# EAGLE schematic main (EAGLE 8.7.1)

## Sheet 1 of 4: Main board
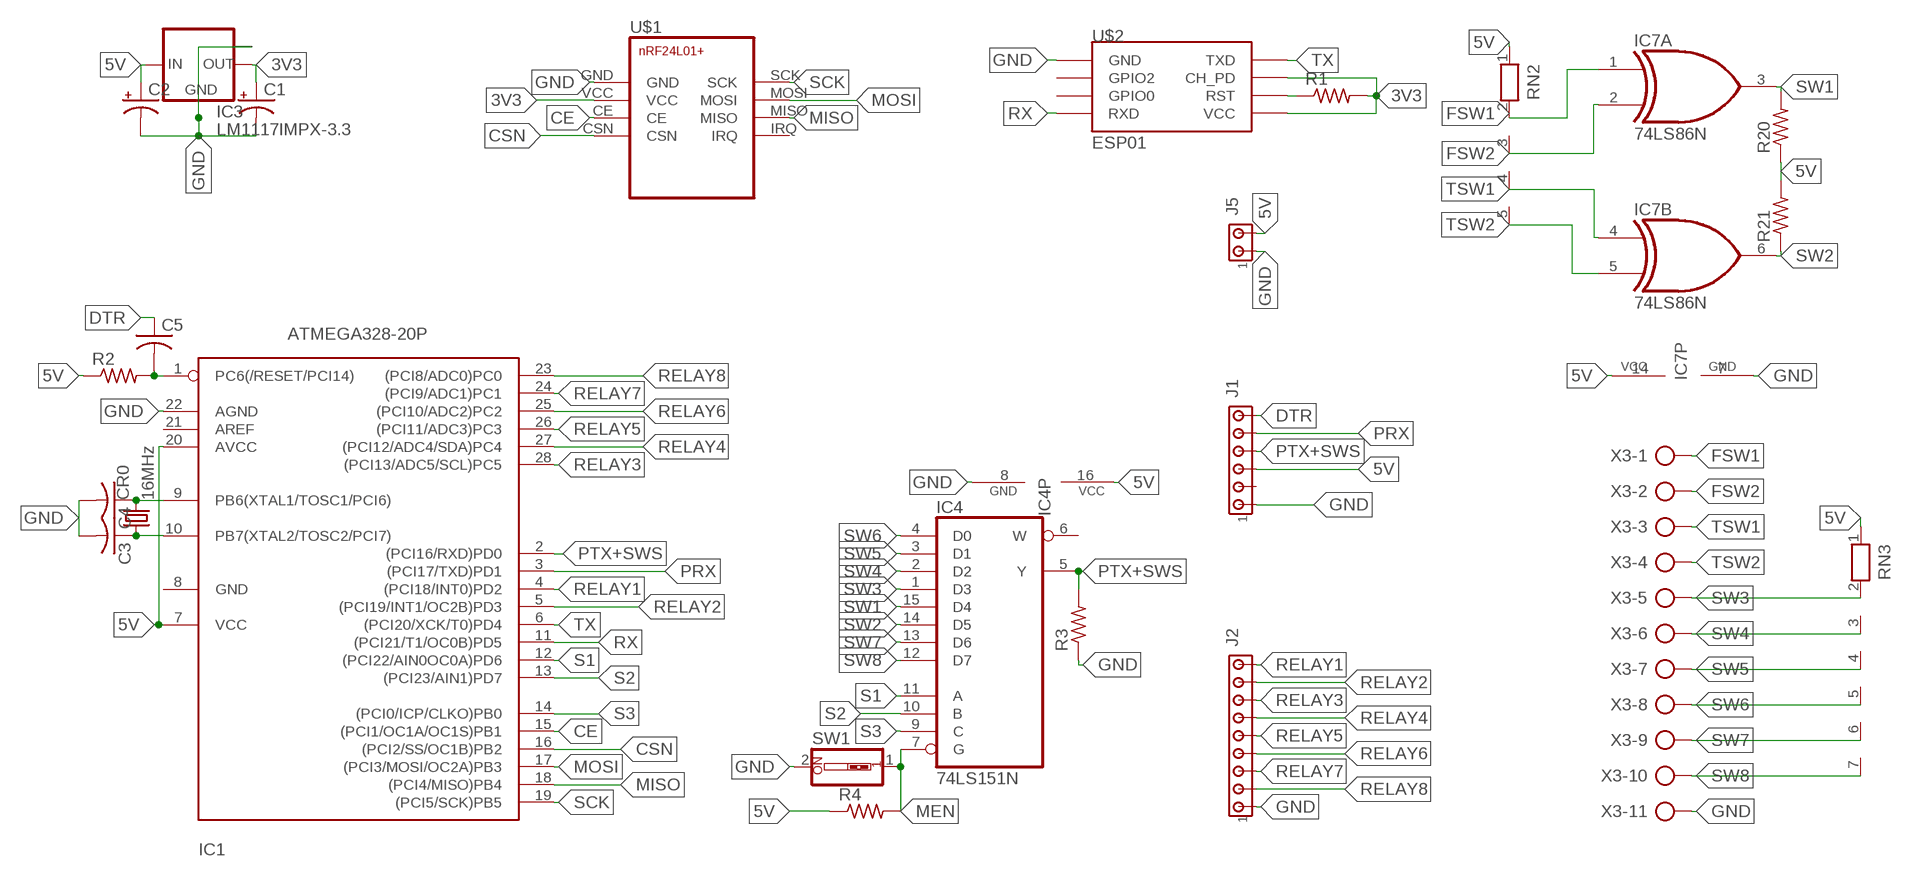
[diagram p0: schematic, sheet 1]

### Parts
C1  CPOL-USE2,5-6E  [E2,5-6E]
C2  CPOL-USE2,5-6E  [E2,5-6E]
C3  C-USC1206  [C1206]
C4  C-USC1206  [C1206]
C5  C-USC1206  [C1206]
CR0  16MHz  CRYSTALHC18U-V  [HC18U-V]
IC1  ATMEGA328-20P  [DIL28-3]
IC3  LM1117IMPX-3.3  [SOT223]
IC4  74LS151N  [DIL16]
IC7  74LS86N  [DIL14]
J1  MTA06-100  [10X06MTA]
J2  MTA09-100  [10X09MTA]
J5  MTA02-100  [10X02MTA]
R1  R-US_R1206  [R1206]
R2  R-US_R1206  [R1206]
R3  R-US_R1206  [R1206]
R4  R-US_R1206  [R1206]
R20  R-US_0204/7  [0204/7]
R21  R-US_R1206  [R1206]
RN2  RN04  [RN-5]
RN3  RN06  [RN-7]
SW1  SW_DIP-1  [EDG-01]
U$1  NRF24L01+  [NRF24L01+]
U$2  ESP01  [ESP01]
X3  AK300/11  [AK300/11]

### Nets
3V3: C1.+ IC3.2(OUT) R1.2 U$1.VCC U$2.CH_PD U$2.VCC
5V: C2.+ IC1.7(VCC) IC1.20(AVCC) IC3.3(IN) IC4.16(VCC) IC7.14(P:VCC) J1.3 J5.2 R2.1 R4.1 R20.1 R21.2 RN2.1 RN3.1
CE: IC1.15((PCI1/OC1A/OC1S)PB1) U$1.CE
CR1: C4.1 CR0.2 IC1.9(PB6(XTAL1/TOSC1/PCI6))
CR2: C3.1 CR0.1 IC1.10(PB7(XTAL2/TOSC2/PCI7))
CSN: IC1.16((PCI2/SS/OC1B)PB2) U$1.CSN
DTR: C5.1 J1.6
ERST: R1.1 U$2.RST
FSW1: IC7.1(A:I0) RN2.2 X3.1
FSW2: IC7.2(A:I1) RN2.3 X3.2
GND: C1.- C2.- C3.2 C4.2 IC1.22(AGND) IC3.1(GND) IC3.TAB(OUT1) IC4.8(GND) IC7.7(P:GND) J1.1 J2.1 J5.1 R3.1 SW1.2 U$1.GND U$2.GND X3.11
MEN: IC4.7(G) R4.2 SW1.1
MISO: IC1.18((PCI4/MISO)PB4) U$1.MISO
MOSI: IC1.17((PCI3/MOSI/OC2A)PB3) U$1.MOSI
MRST: C5.2 IC1.1(PC6(/RESET/PCI14)) R2.2
PRX: IC1.3((PCI17/TXD)PD1) J1.5
PTX+SWS: IC1.2((PCI16/RXD)PD0) IC4.5(Y) J1.4 R3.2
RELAY1: IC1.4((PCI18/INT0)PD2) J2.9
RELAY2: IC1.5((PCI19/INT1/OC2B)PD3) J2.8
RELAY3: IC1.28((PCI13/ADC5/SCL)PC5) J2.7
RELAY4: IC1.27((PCI12/ADC4/SDA)PC4) J2.6
RELAY5: IC1.26((PCI11/ADC3)PC3) J2.5
RELAY6: IC1.25((PCI10/ADC2)PC2) J2.4
RELAY7: IC1.24((PCI9/ADC1)PC1) J2.3
RELAY8: IC1.23((PCI8/ADC0)PC0) J2.2
RX: IC1.11((PCI21/T1/OC0B)PD5) U$2.RX(RXD)
S1: IC1.12((PCI22/AIN0OC0A)PD6) IC4.11(A)
S2: IC1.13((PCI23/AIN1)PD7) IC4.10(B)
S3: IC1.14((PCI0/ICP/CLKO)PB0) IC4.9(C)
SCK: IC1.19((PCI5/SCK)PB5) U$1.SCK
SW1: IC4.15(D4) IC7.3(A:O) R20.2
SW2: IC4.14(D5) IC7.6(B:O) R21.1
SW3: IC4.1(D3) RN3.2 X3.5
SW4: IC4.2(D2) RN3.3 X3.6
SW5: IC4.3(D1) RN3.4 X3.7
SW6: IC4.4(D0) RN3.5 X3.8
SW7: IC4.13(D6) RN3.6 X3.9
SW8: IC4.12(D7) RN3.7 X3.10
TSW1: IC7.4(B:I0) RN2.4 X3.3
TSW2: IC7.5(B:I1) RN2.5 X3.4
TX: IC1.6((PCI20/XCK/T0)PD4) U$2.TX(TXD)
Unconnected: IC1.8(GND) IC1.21(AREF) IC4.6(W) IC7.8(C:O) IC7.9(C:I0) IC7.10(C:I1) IC7.11(D:O) IC7.12(D:I0) IC7.13(D:I1) J1.2 U$1.IRQ U$2.GPIO0 U$2.GPIO2

## Sheet 2 of 4: Node 1 (6 relays)
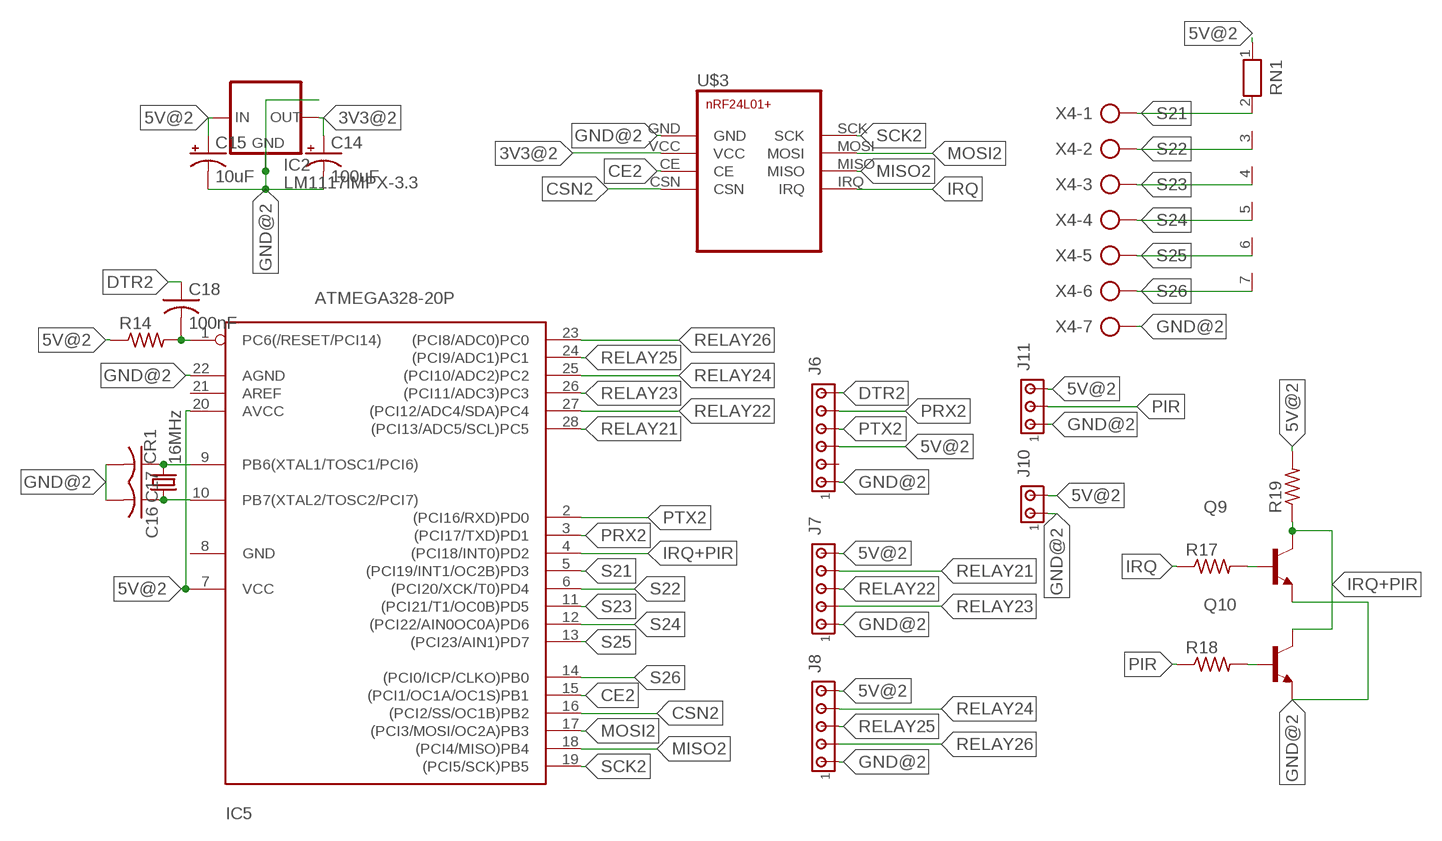
[diagram p1: schematic, sheet 2]

### Parts
C14  100uF  CPOL-USE2,5-6E  [E2,5-6E]
C15  10uF  CPOL-USE2,5-6E  [E2,5-6E]
C16  C-USC1206  [C1206]
C17  C-USC1206  [C1206]
C18  100nF  C-USC1206  [C1206]
CR1  16MHz  CRYSTALHC18U-V  [HC18U-V]
IC2  LM1117IMPX-3.3  [SOT223]
IC5  ATMEGA328-20P  [DIL28-3]
J6  MTA06-100  [10X06MTA]
J7  MTA05-100  [10X05MTA]
J8  MTA05-100  [10X05MTA]
J10  MTA02-100  [10X02MTA]
J11  MTA03-100  [10X03MTA]
Q9  -NPN-SOT89-BCE  [SOT89-BCE]
Q10  -NPN-SOT89-BCE  [SOT89-BCE]
R14  R-US_R1206  [R1206]
R17  R-US_R1206  [R1206]
R18  R-US_R1206  [R1206]
R19  R-US_R1206  [R1206]
RN1  RN06  [RN-7]
U$3  NRF24L01+  [NRF24L01+]
X4  AK300/7  [AK300/7]

### Nets
3V3@2: C14.+ IC2.2(OUT) U$3.VCC
5V@2: C15.+ IC2.3(IN) IC5.7(VCC) IC5.20(AVCC) J6.3 J7.5 J8.5 J10.2 J11.3 R14.1 R19.2 RN1.1
CE2: IC5.15((PCI1/OC1A/OC1S)PB1) U$3.CE
CR3: C16.1 CR1.1 IC5.10(PB7(XTAL2/TOSC2/PCI7))
CR4: C17.1 CR1.2 IC5.9(PB6(XTAL1/TOSC1/PCI6))
CSN2: IC5.16((PCI2/SS/OC1B)PB2) U$3.CSN
DTR2: C18.1 J6.6
GND@2: C14.- C15.- C16.2 C17.2 IC2.1(GND) IC2.TAB(OUT1) IC5.22(AGND) J6.1 J7.1 J8.1 J10.1 J11.1 Q9.E Q10.E U$3.GND X4.7
IRQ: R17.1 U$3.IRQ
IRQ+PIR: IC5.4((PCI18/INT0)PD2) Q9.C Q10.C R19.1
MISO2: IC5.18((PCI4/MISO)PB4) U$3.MISO
MOSI2: IC5.17((PCI3/MOSI/OC2A)PB3) U$3.MOSI
MRST1: C18.2 IC5.1(PC6(/RESET/PCI14)) R14.2
N$49: Q9.B R17.2
N$50: Q10.B R18.2
PIR: J11.2 R18.1
PRX2: IC5.3((PCI17/TXD)PD1) J6.5
PTX2: IC5.2((PCI16/RXD)PD0) J6.4
RELAY21: IC5.28((PCI13/ADC5/SCL)PC5) J7.4
RELAY22: IC5.27((PCI12/ADC4/SDA)PC4) J7.3
RELAY23: IC5.26((PCI11/ADC3)PC3) J7.2
RELAY24: IC5.25((PCI10/ADC2)PC2) J8.4
RELAY25: IC5.24((PCI9/ADC1)PC1) J8.3
RELAY26: IC5.23((PCI8/ADC0)PC0) J8.2
S21: IC5.5((PCI19/INT1/OC2B)PD3) RN1.2 X4.1
S22: IC5.6((PCI20/XCK/T0)PD4) RN1.3 X4.2
S23: IC5.11((PCI21/T1/OC0B)PD5) RN1.4 X4.3
S24: IC5.12((PCI22/AIN0OC0A)PD6) RN1.5 X4.4
S25: IC5.13((PCI23/AIN1)PD7) RN1.6 X4.5
S26: IC5.14((PCI0/ICP/CLKO)PB0) RN1.7 X4.6
SCK2: IC5.19((PCI5/SCK)PB5) U$3.SCK
Unconnected: IC5.8(GND) IC5.21(AREF) J6.2

## Sheet 3 of 4: Relay board - 9
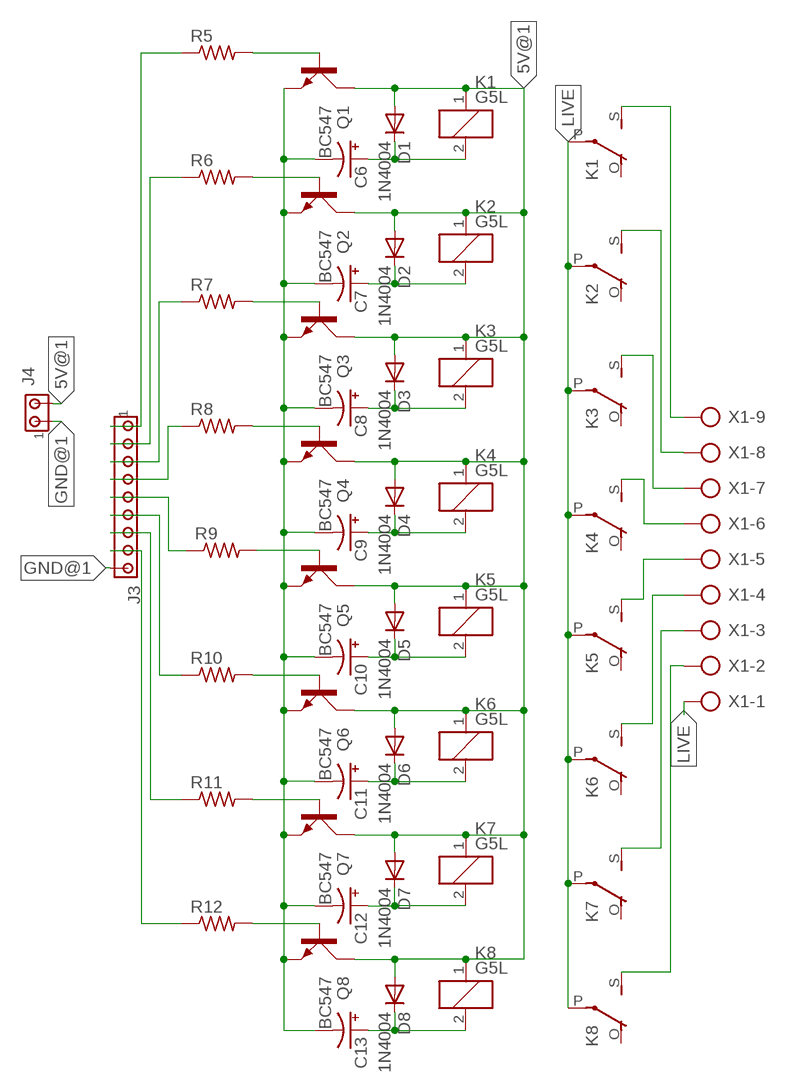
[diagram p2: schematic, sheet 3]

### Parts
C6  CPOL-USE2.5-6  [E2,5-6]
C7  CPOL-USE2.5-6  [E2,5-6]
C8  CPOL-USE2.5-6  [E2,5-6]
C9  CPOL-USE2.5-6  [E2,5-6]
C10  CPOL-USE2.5-6  [E2,5-6]
C11  CPOL-USE2.5-6  [E2,5-6]
C12  CPOL-USE2.5-6  [E2,5-6]
C13  CPOL-USE2.5-6  [E2,5-6]
D1  1N4004  [DO41-10]
D2  1N4004  [DO41-10]
D3  1N4004  [DO41-10]
D4  1N4004  [DO41-10]
D5  1N4004  [DO41-10]
D6  1N4004  [DO41-10]
D7  1N4004  [DO41-10]
D8  1N4004  [DO41-10]
J3  MTA09-100  [10X09MTA]
J4  MTA02-100  [10X02MTA]
K1  G5L  [G5LE]
K2  G5L  [G5LE]
K3  G5L  [G5LE]
K4  G5L  [G5LE]
K5  G5L  [G5LE]
K6  G5L  [G5LE]
K7  G5L  [G5LE]
K8  G5L  [G5LE]
Q1  BC547  [SOT54A]
Q2  BC547  [SOT54A]
Q3  BC547  [SOT54A]
Q4  BC547  [SOT54A]
Q5  BC547  [SOT54A]
Q6  BC547  [SOT54A]
Q7  BC547  [SOT54A]
Q8  BC547  [SOT54A]
R5  R-US_0204/7  [0204/7]
R6  R-US_0204/7  [0204/7]
R7  R-US_0204/7  [0204/7]
R8  R-US_0204/7  [0204/7]
R9  R-US_0204/7  [0204/7]
R10  R-US_0204/7  [0204/7]
R11  R-US_0204/7  [0204/7]
R12  R-US_0204/7  [0204/7]
X1  AK300/9  [AK300/9]

### Nets
5V@1: D1.A D2.A D3.A D4.A D5.A D6.A D7.A D8.A J4.2 K1.1 K2.1 K3.1 K4.1 K5.1 K6.1 K7.1 K8.1 Q1.C Q2.C Q3.C Q4.C Q5.C Q6.C Q7.C Q8.C
GND@1: C6.- C7.- C8.- C9.- C10.- C11.- C12.- C13.- J3.9 J4.1 Q1.E Q2.E Q3.E Q4.E Q5.E Q6.E Q7.E Q8.E
LIVE: K1.P(2:P) K2.P(2:P) K3.P(2:P) K4.P(2:P) K5.P(2:P) K6.P(2:P) K7.P(2:P) K8.P(2:P) X1.1
N$2: Q1.B R5.2
N$3: Q2.B R6.2
N$4: Q3.B R7.2
N$5: Q4.B R8.2
N$6: Q5.B R9.2
N$7: Q6.B R10.2
N$8: Q7.B R11.2
N$9: Q8.B R12.2
N$10: J3.1 R5.1
N$11: J3.8 R12.1
N$12: J3.7 R11.1
N$13: J3.6 R10.1
N$14: J3.5 R9.1
N$15: J3.4 R8.1
N$16: J3.3 R7.1
N$17: J3.2 R6.1
N$18: K1.S(2:S) X1.9
N$19: K8.S(2:S) X1.2
N$20: K7.S(2:S) X1.3
N$21: K6.S(2:S) X1.4
N$22: K5.S(2:S) X1.5
N$23: K4.S(2:S) X1.6
N$24: K3.S(2:S) X1.7
N$25: K2.S(2:S) X1.8
N$28: C7.+ D2.C K2.2
N$29: C8.+ D3.C K3.2
N$30: C9.+ D4.C K4.2
N$31: C10.+ D5.C K5.2
N$32: C11.+ D6.C K6.2
N$33: C12.+ D7.C K7.2
N$34: C13.+ D8.C K8.2
N$35: C6.+ D1.C K1.2
Unconnected: K1.O(2:O) K2.O(2:O) K3.O(2:O) K4.O(2:O) K5.O(2:O) K6.O(2:O) K7.O(2:O) K8.O(2:O)

## Sheet 4 of 4: Relay board - 3
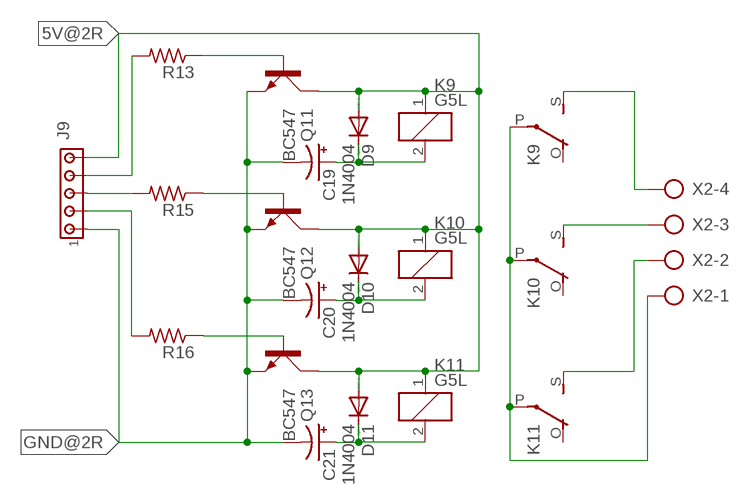
[diagram p3: schematic, sheet 4]

### Parts
C19  CPOL-USE2.5-6  [E2,5-6]
C20  CPOL-USE2.5-6  [E2,5-6]
C21  CPOL-USE2.5-6  [E2,5-6]
D9  1N4004  [DO41-10]
D10  1N4004  [DO41-10]
D11  1N4004  [DO41-10]
J9  MTA05-100  [10X05MTA]
K9  G5L  [G5LE]
K10  G5L  [G5LE]
K11  G5L  [G5LE]
Q11  BC547  [SOT54A]
Q12  BC547  [SOT54A]
Q13  BC547  [SOT54A]
R13  R-US_0204/7  [0204/7]
R15  R-US_0204/7  [0204/7]
R16  R-US_0204/7  [0204/7]
X2  AK300/4  [AK300/4]

### Nets
5V@2R: D9.A D10.A D11.A J9.5 K9.1 K10.1 K11.1 Q11.C Q12.C Q13.C
GND@2R: C19.- C20.- C21.- J9.1 Q11.E Q12.E Q13.E
N$1: K9.P(2:P) K10.P(2:P) K11.P(2:P) X2.1
N$27: C19.+ D9.C K9.2
N$36: K10.S(2:S) X2.3
N$37: C20.+ D10.C K10.2
N$38: K9.S(2:S) X2.4
N$39: C21.+ D11.C K11.2
N$40: K11.S(2:S) X2.2
N$41: Q11.B R13.1
N$42: Q13.B R16.1
N$43: Q12.B R15.1
N$44: J9.3 R15.2
N$45: J9.4 R13.2
N$46: J9.2 R16.2
Unconnected: K9.O(2:O) K10.O(2:O) K11.O(2:O)

## Library data of the parts
C1 C2 C6-C15 C19-C21 = adafruit:CPOL-US: POLARIZED CAPACITOR, American symbol
C3-C5 C16-C18 = adafruit:C-US: CAPACITOR, American symbol
CR0 CR1 = adafruit:CRYSTAL: CRYSTAL; OC_FARNELL: unknown; OC_NEWARK: unknown
D1-D8 = adafruit:1N4004: DIODE
D9-D11 = diode:1N4004: DIODE
IC1 IC5 = atmega328:ATMEGA328*P: MICROCONTROLLER 32 kBytes FLASH 2 kBytes SRAM 1 kBytes EEPROM USART 8-channel 10 bit ADC
IC2 IC3 = lm1117:LM1117IMPX-*
IC4 = 74xx-us:74*151: Data SELECTOR/MULTIPLEXER
IC7 = 74xx-us:74*86: Quad 2-input EXCLUSIV-OR (XOR) gate
J1 J6 = con-amp:MTA06-100: AMP connector Connection corrected 2014-09-19
J2 J3 = con-amp:MTA09-100: AMP connector
J4 J5 J10 = con-amp:MTA02-100: AMP connector
J7-J9 = con-amp:MTA05-100: AMP connector
J11 = con-amp:MTA03-100: AMP connector
K1-K11 = relay:G5L: RELAY 1 x switch, 10 A/120 V AC, 8 A/30 V ADC, Omron; OC_FARNELL: unknown; OC_NEWARK: unknown
Q1-Q8 Q11-Q13 = transistor-small-signal:BC547: NPN TRANSISTOR
Q9 Q10 = transistor:*-NPN-: NPN Transistror BF959 corrected 2008.03.06
R1-R21 = adafruit:R-US_: RESISTOR, American symbol
RN1 RN3 = resistor-net:RN06: RESISTOR NETWORK; OC_FARNELL: unknown; OC_NEWARK: unknown
RN2 = resistor-net:RN04: RESISTOR NETWORK; OC_FARNELL: unknown; OC_NEWARK: unknown
SW1 = special:SW_DIP-1: DIP SWITCH
U$1 U$3 = nrf24l01:NRF24L01+: nRF24L01+ Transceiver Module
U$2 = esp8266:ESP01: ESP8266 Wifi module 01
X1 = con-ptr500:AK300/9: CONNECTOR; OC_FARNELL: unknown; OC_NEWARK: unknown
X2 = con-ptr500:AK300/4: CONNECTOR; OC_FARNELL: unknown; OC_NEWARK: unknown
X3 = con-ptr500:AK300/11: CONNECTOR; OC_FARNELL: unknown; OC_NEWARK: unknown
X4 = con-ptr500:AK300/7: CONNECTOR; OC_FARNELL: unknown; OC_NEWARK: unknown